# Altium schematic sheet Motortreiber_1,2.SchDoc: SysP18_Team10: Motortreiber 1/2
size A4; Author: Michael Alig; CompanyName: NTB; Organization: NTB Interstate University of Applied; Address1: Werdenbergstrasse 4; Address3: 9471 Buchs; Address4: Switzerland; SheetNumber: 3; SheetTotal: 5; Organization1: Sciences of Technology Buchs; Size: A4; ShortDescription: Motortreiber Motor1, Motor2
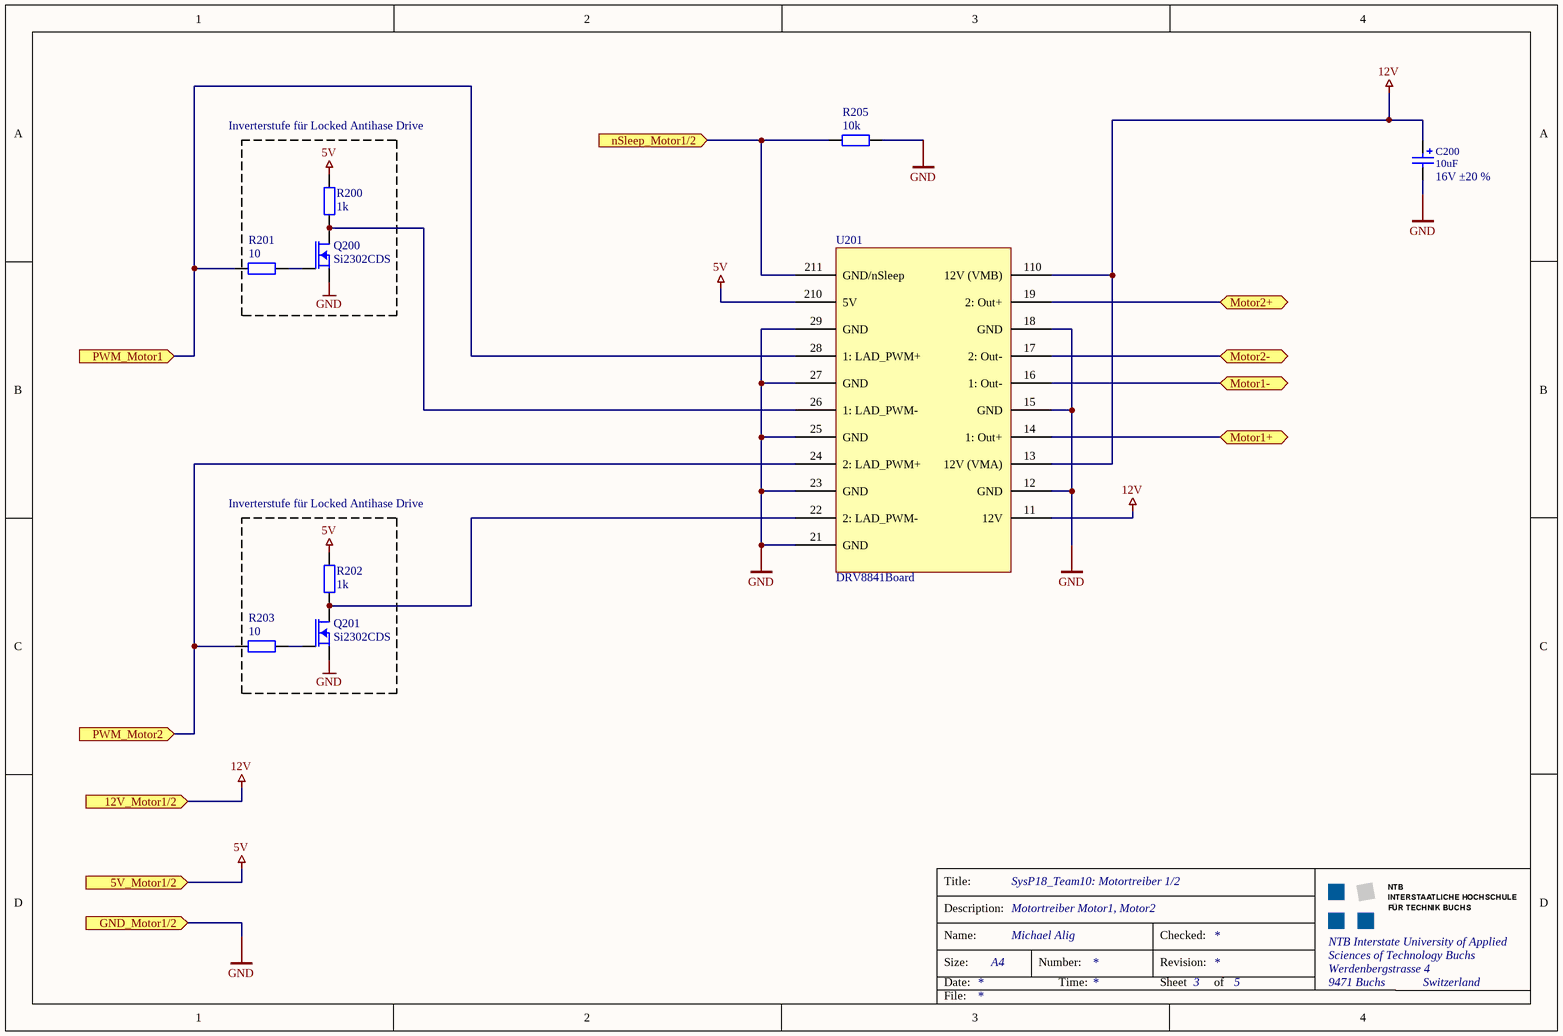
[diagram p0: Motortreiber_1,2.SchDoc]

## Parts
C200  value 10uF  ValueAddon: 16V ±20 %  [CDE_CAP AVE CODE D_H]  (hidden comment: AVE476M16D16T-F)
Q200  Si2302CDS  [SOT23-3]
Q201  Si2302CDS  [SOT23-3]
R200  value 1k  [GEN_R0805_H]  (hidden comment: Generic)
R201  value 10  [GEN_R0805_H]  (hidden comment: Generic)
R202  value 1k  [GEN_R0805_H]  (hidden comment: Generic)
R203  value 10  [GEN_R0805_H]  (hidden comment: Generic)
R205  value 10k  [GEN_R0805_H]  (hidden comment: Generic)
U201  DRV8841Board  [DRV8841_Board]

## Ports
5V_Motor1/2 (in), 12V_Motor1/2 (in), GND_Motor1/2 (in), Motor1+, Motor1-, Motor2+, Motor2-, nSleep_Motor1/2 (in), PWM_Motor1 (in), PWM_Motor2 (in)

## Nets
5V: R200.2 R202.2 U201.210(5V) ; port 5V_Motor1/2
12V: C200.1(Pos) U201.11(12V) U201.13(12V_(VMA)) U201.110(12V_(VMB)) ; port 12V_Motor1/2
GND: C200.2(Neg) Q200.2(S) Q201.2(S) R205.2 U201.12(GND) U201.15(GND) U201.18(GND) U201.21(GND) U201.23(GND) U201.25(GND) U201.27(GND) U201.29(GND) ; port GND_Motor1/2
Motor1+: U201.14(1:_Out+) ; port Motor1+
Motor1-: U201.16(1:_Out-) ; port Motor1-
Motor2+: U201.19(2:_Out+) ; port Motor2+
Motor2-: U201.17(2:_Out-) ; port Motor2-
nSleep_Motor1/2: R205.1 U201.211(GND/nSleep) ; port nSleep_Motor1/2
PWM_Motor1: R201.1 U201.28(1:_LAD_PWM+) ; port PWM_Motor1
PWM_Motor2: R203.1 U201.24(2:_LAD_PWM+) ; port PWM_Motor2
NetQ200_1: Q200.1(G) R201.2
NetQ200_3: Q200.3(D) R200.1 U201.26(1:_LAD_PWM-)
NetQ201_1: Q201.1(G) R203.2
NetQ201_3: Q201.3(D) R202.1 U201.22(2:_LAD_PWM-)

## Notes on the sheet
- Inverterstufe für Locked Antihase Drive
- Title:
- Description:
- Size:
- Date:
- Name:
- Number:
- Time:
- Revision:
- Sheet
- Checked:
- of
- File:

## Library data of the parts
C200 = CDE_AVE476M16D16T-F_AVE CODE D: Aluminum Electrolytic Capacitors for Filtering and Bypass, 47uF, 16V; Manufacturer: Cornell Dubilier; #Class: PASSIVE; RefFootprint: CDE_CAP AVE CODE D; #ClassSub: CAPACITOR; Distributor PartNr: 598-AVE476M16D16T-F; Distributor: Mouser; Published: 20121220; Publisher: Stefan Ursella, M.Eng; ComponentLink1Description: Manufacturer Link; ComponentLink2Description: Datasheet; ComponentLink2URL: http://www.cde.com/catalogs/AVE.pdf; ComponentLink3Description: Packaging Specification; Manufacturer PartNr: AVE476M16D16T-F; RefFileFOO: *; RefFileSCH: *; RefSchema: CDE_AVE476M16D16T-F_AVE CODE D
Q200 Q201 = Depletion Mode MOSFET: N-Channel 20V (D-S) MOSFET; ID: 2.9A; RDSON: 57mR; VDSS: 20V; ComponentLink1Description: Datasheet Si2302CDS; ComponentLink1URL: V:\MosFets\si2302cds.pdf
R200-R203 R205 = GEN_R_2: generic resistor; Manufacturer: Tbd; #Class: PASSIVE; Published: 8-Jun-2000; Publisher: Altium Limited; #ClassSub: RESISTOR; ComponentLink1Description: Manufacturer Link; ComponentLink2Description: Datasheet; ComponentLink3Description: Packaging Specification; Distributor: tbd; RefFootprint: GEN_R0805_H; Manufacturer PartNr: tbd; Distributor PartNr: tbd; RefFileFOO: *; RefFileSCH: *; RefSchema: GEN_R_2
U201 = DRV8841_Board